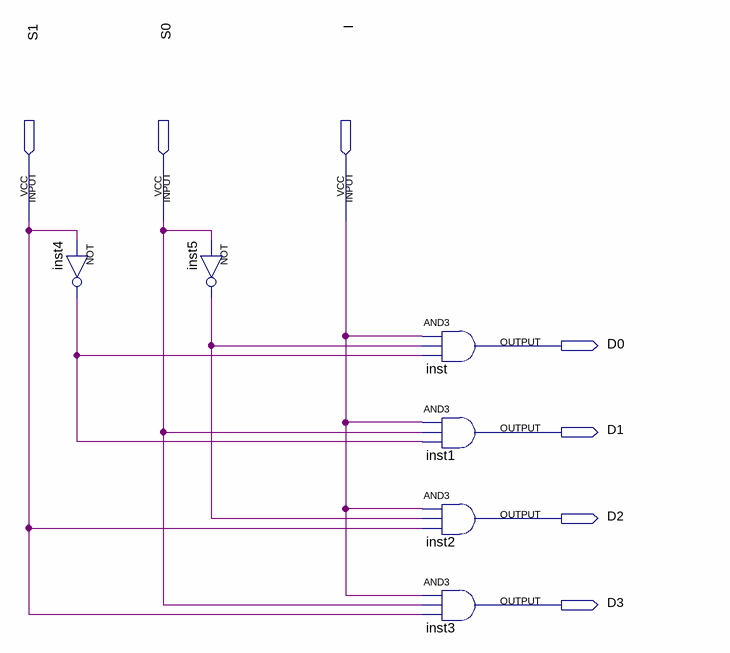
[diagram p0: schematic sheet]
// Quartus schematic single_demux.bdf as structural Verilog: 6 symbols, 7 pins
module single_demux (
  input  S1,
  input  S0,
  input  I,
  output D0,
  output D1,
  output D2,
  output D3
);

  wire inst4_out, inst5_out;

  not inst4 (inst4_out, S1);
  not inst5 (inst5_out, S0);
  and inst (D0, I, inst5_out, inst4_out);
  and inst1 (D1, I, S0, inst4_out);
  and inst2 (D2, I, inst5_out, S1);
  and inst3 (D3, I, S0, S1);
endmodule
